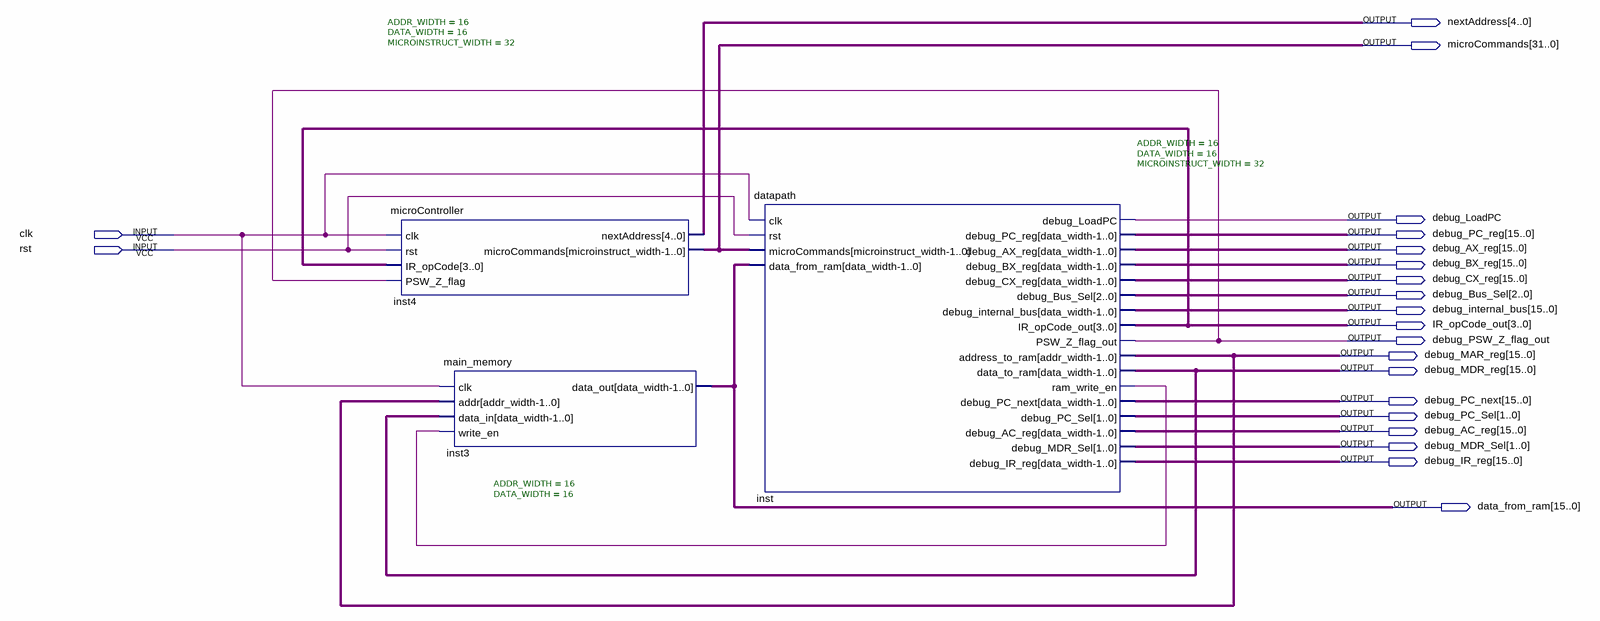
[diagram p0: schematic sheet]
// Quartus schematic cpu_fibo.bdf as structural Verilog: 3 symbols, 21 pins
module cpu_fibo (
  input  clk,
  input  rst,
  output [4:0] nextAddress,
  output [31:0] microCommands,
  output debug_LoadPC,
  output [15:0] debug_PC_reg,
  output [15:0] debug_AX_reg,
  output [15:0] debug_BX_reg,
  output [15:0] debug_CX_reg,
  output [2:0] debug_Bus_Sel,
  output [15:0] debug_internal_bus,
  output [3:0] IR_opCode_out,
  output debug_PSW_Z_flag_out,
  output [15:0] debug_MAR_reg,
  output [15:0] debug_MDR_reg,
  output [15:0] debug_PC_next,
  output [1:0] debug_PC_Sel,
  output [15:0] debug_AC_reg,
  output [1:0] debug_MDR_Sel,
  output [15:0] debug_IR_reg,
  output [15:0] data_from_ram
);

  wire inst_ram_write_en;

  microController #(.ADDR_WIDTH(16), .DATA_WIDTH(16), .MICROINSTRUCT_WIDTH(32)) inst4 (
    .clk(clk), .rst(rst), .IR_opCode(IR_opCode_out), .PSW_Z_flag(debug_PSW_Z_flag_out),
    .nextAddress(nextAddress), .microCommands(microCommands));
  main_memory #(.ADDR_WIDTH(16), .DATA_WIDTH(16)) inst3 (
    .clk(clk), .addr(debug_MAR_reg), .data_in(debug_MDR_reg), .write_en(inst_ram_write_en),
    .data_out(data_from_ram));
  datapath #(.ADDR_WIDTH(16), .DATA_WIDTH(16), .MICROINSTRUCT_WIDTH(32)) inst (
    .clk(clk), .rst(rst), .microCommands(microCommands), .data_from_ram(data_from_ram),
    .debug_LoadPC(debug_LoadPC), .debug_PC_reg(debug_PC_reg), .debug_AX_reg(debug_AX_reg),
    .debug_BX_reg(debug_BX_reg), .debug_CX_reg(debug_CX_reg), .debug_Bus_Sel(debug_Bus_Sel),
    .debug_internal_bus(debug_internal_bus), .IR_opCode_out(IR_opCode_out),
    .PSW_Z_flag_out(debug_PSW_Z_flag_out), .address_to_ram(debug_MAR_reg), .data_to_ram(debug_MDR_reg),
    .ram_write_en(inst_ram_write_en), .debug_PC_next(debug_PC_next), .debug_PC_Sel(debug_PC_Sel),
    .debug_AC_reg(debug_AC_reg), .debug_MDR_Sel(debug_MDR_Sel), .debug_IR_reg(debug_IR_reg));
endmodule
